# EAGLE design qo-100-relay-controller (EAGLE 9.6.1)
CNAME: None; CREVISION: 1; DESIGNER: Joao Silva

## Sheet 1 of 2: MCU
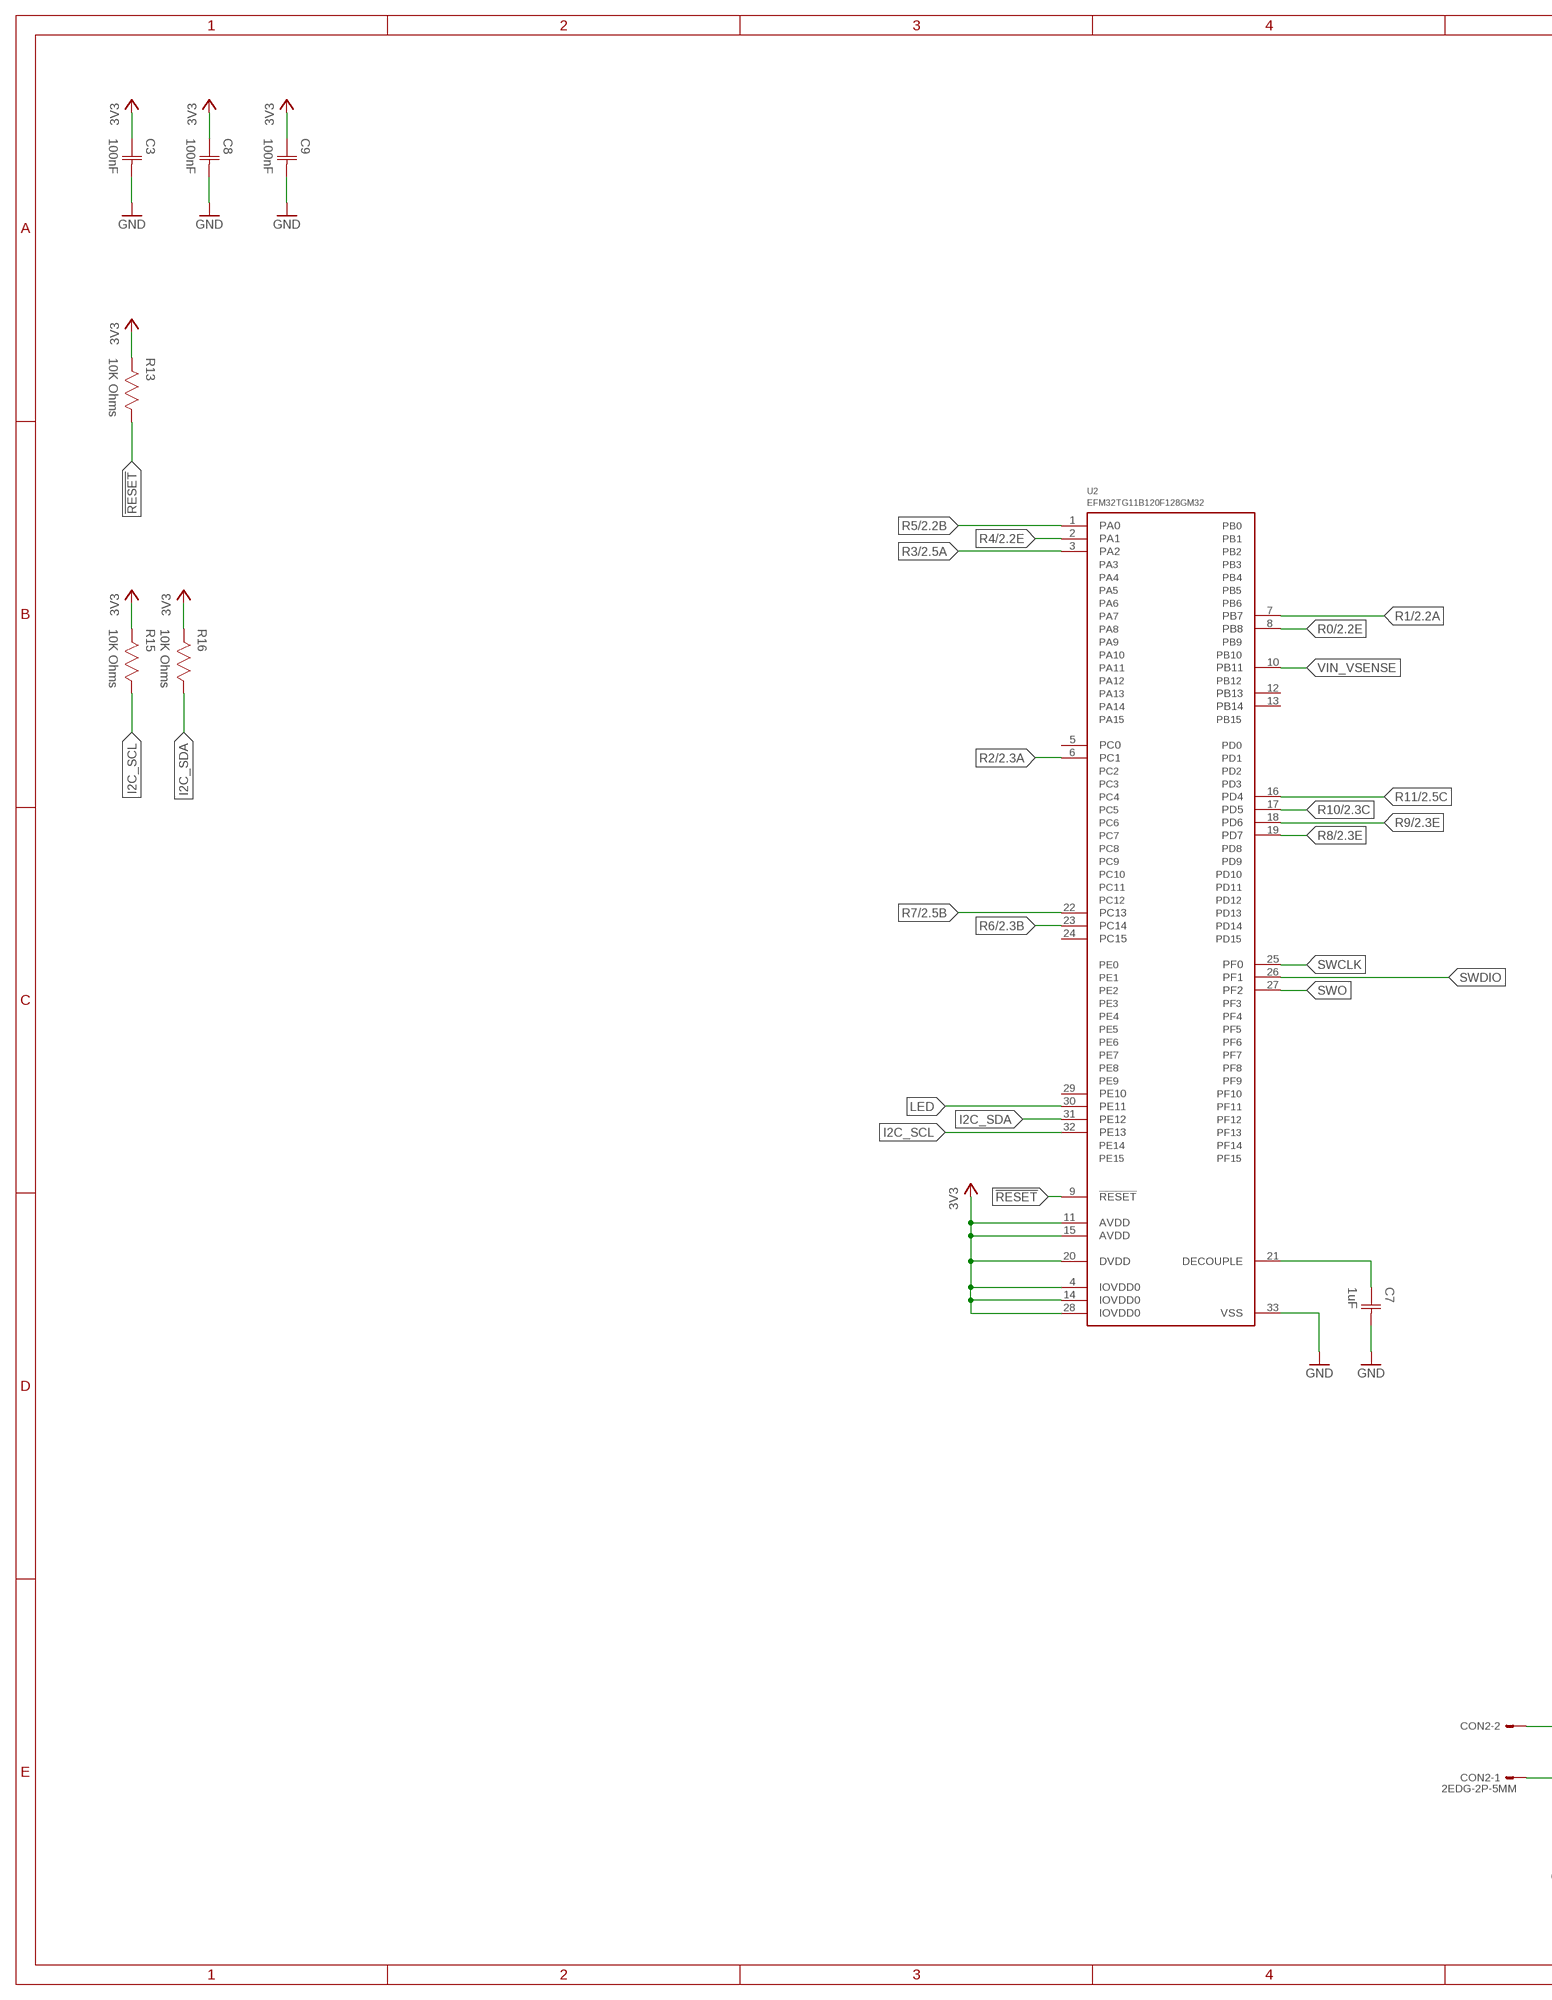
[diagram p0: schematic, sheet 1, part 1 of 2]
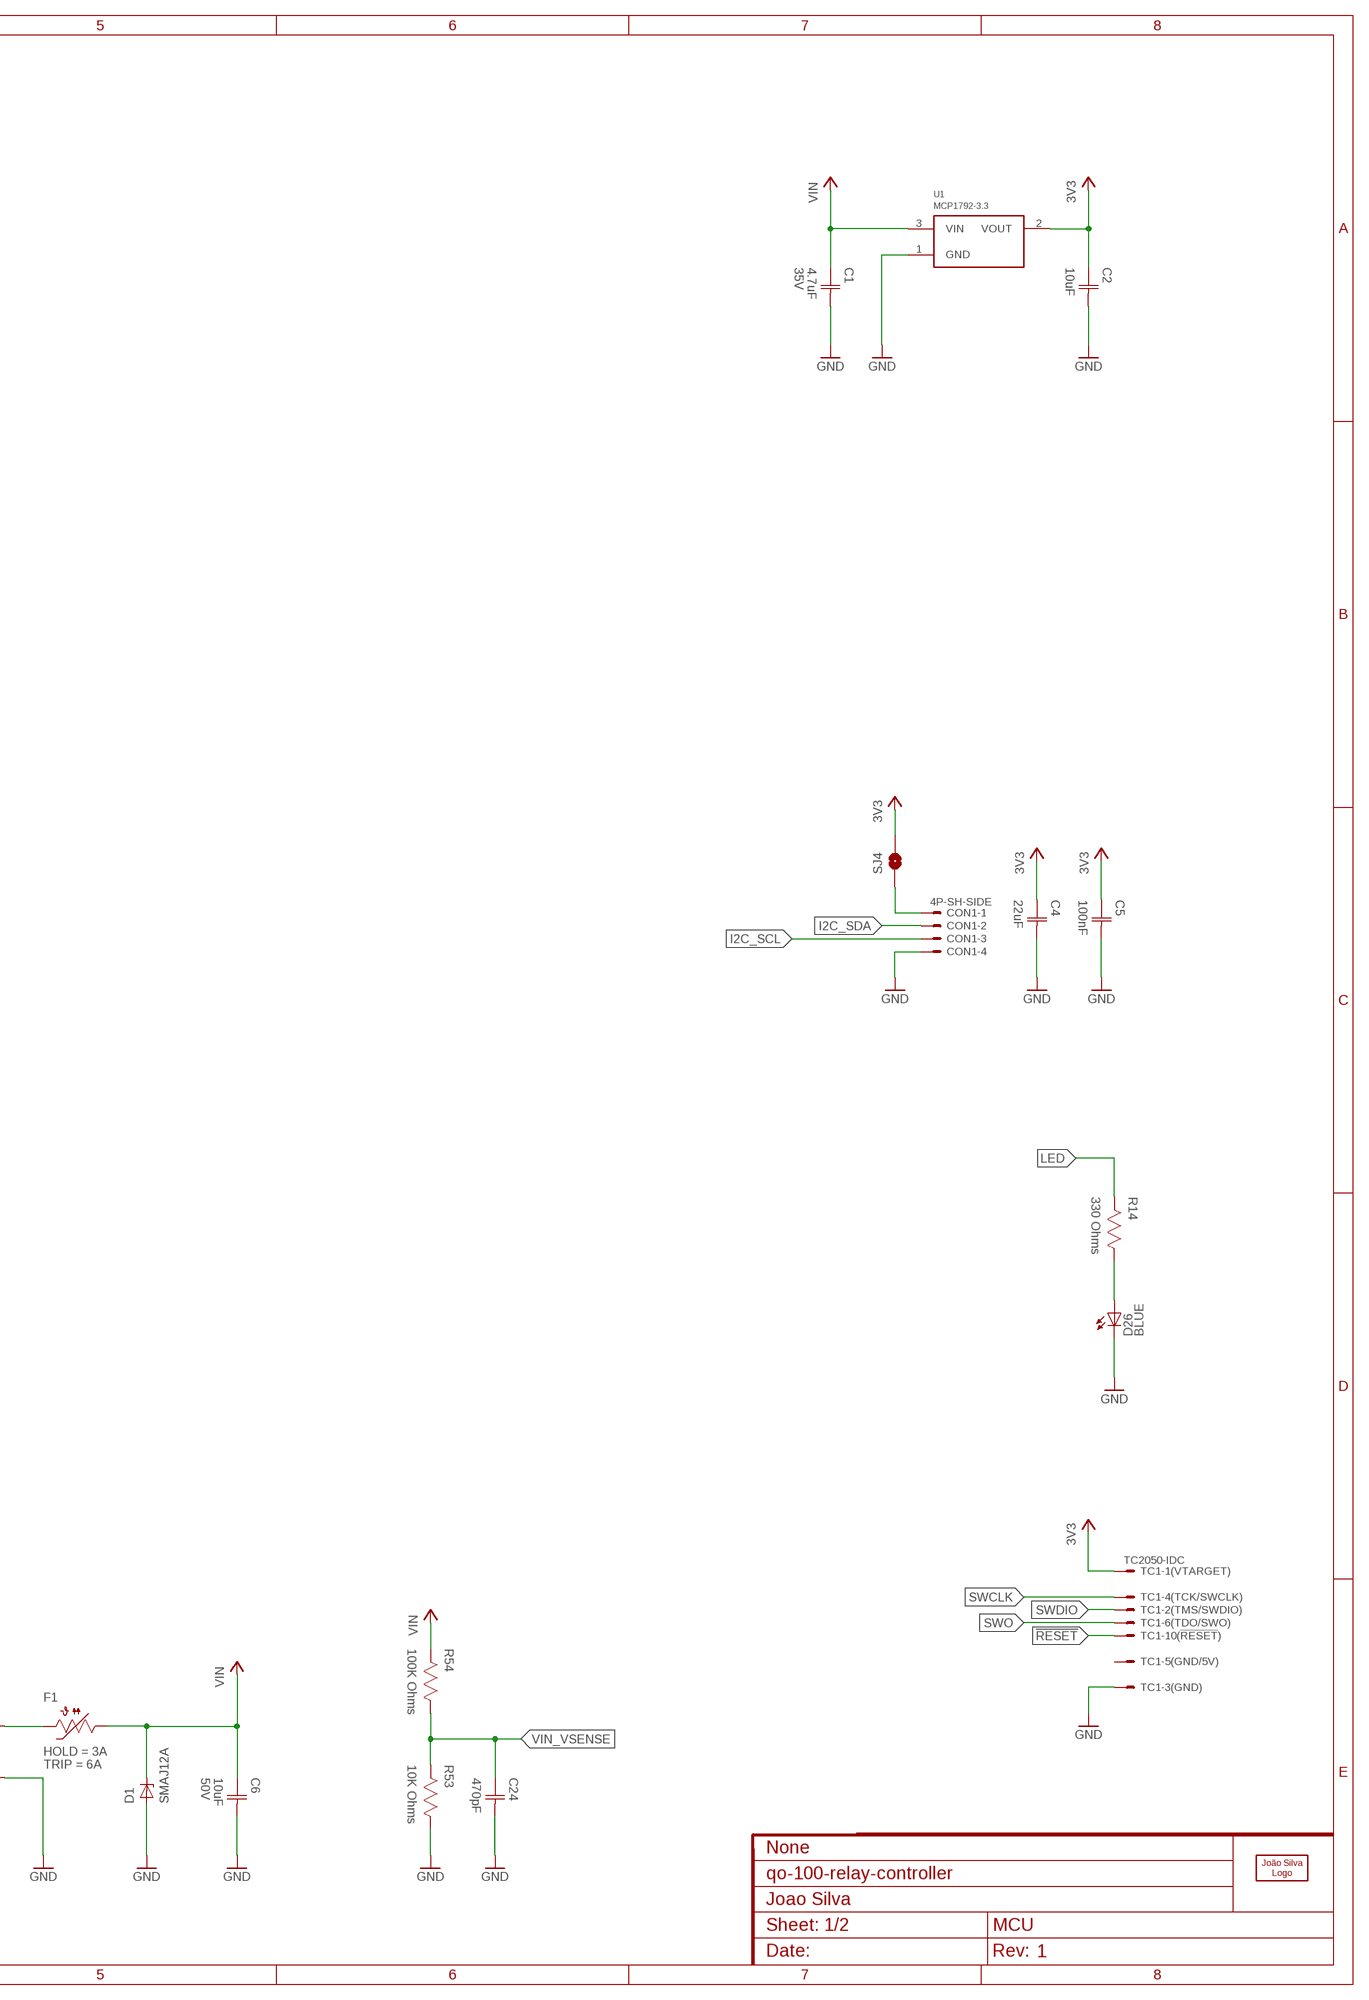
[diagram p1: schematic, sheet 1, part 2 of 2]

### Parts
C1  4.7uF  CAPACITOR-0603  [CAP0603]
C2  10uF  CAPACITOR-0603  [CAP0603]
C3  100nF  CAPACITOR-0603  [CAP0603]
C4  22uF  CAPACITOR-1206  [CAP1206]
C5  100nF  CAPACITOR-0603  [CAP0603]
C6  10uF  CAPACITOR-1206  [CAP1206]
C7  1uF  CAPACITOR-0603  [CAP0603]
C8  100nF  CAPACITOR-0603  [CAP0603]
C9  100nF  CAPACITOR-0603  [CAP0603]
C24  470pF  CAPACITOR-0603  [CAP0603]
CON1  4P-SH-SIDE  [SH-04-SIDE]
CON2  2EDG-2P-5MM  [2EDG-2P-5MM]
D1  SMAJ12A  [DO214AC]
D26  LED0603  [0603]
F1  2.6A Hold  PTC1206  [1206]
LOGO1  JS-5MM  [JS_5MM]
R13  10K Ohms  RESISTOR-0603  [RES0603]
R14  330 Ohms  RESISTOR-0603  [RES0603]
R15  10K Ohms  RESISTOR-0603  [RES0603]
R16  10K Ohms  RESISTOR-0603  [RES0603]
R53  10K Ohms  RESISTOR-0603  [RES0603]
R54  100K Ohms  RESISTOR-0603  [RES0603]
SJ4  SJS  [SJ_S]
TC1  TC2050-IDC  [TC2050-IDC]
U1  MCP1792-3.3  [SOT23]
U2  EFM32TG11B120F128GM32  [QFN32_0.5P_TG]

### Nets
3V3: C2.1(C1) C3.1(C1) C4.1(C1) C5.1(C1) C8.1(C1) C9.1(C1) R13.2 R15.2 R16.2 SJ4.2 TC1.1 U1.2(VOUT) U2.4(IOVDD0) U2.11(AVDD) U2.14(IOVDD0) U2.15(AVDD) U2.20(DVDD) U2.28(IOVDD0) ; also sheet 2
!RESET: R13.1 TC1.10 U2.9(!RESET)
GND: C1.2(C2) C2.2(C2) C3.2(C2) C4.2(C2) C5.2(C2) C6.2(C2) C7.2(C2) C8.2(C2) C9.2(C2) C24.2(C2) CON1.4 CON2.P$1 D1.A D26.C R53.1 TC1.3 U1.1(GND) U2.33(VSS) ; also sheet 2
I2C_SCL: CON1.3 R15.1 U2.32(PE13)
I2C_SDA: CON1.2 R16.1 U2.31(PE12)
LED: R14.2 U2.30(PE11)
N$5: CON1.1 SJ4.1
N$14: C7.1(C1) U2.21(DECOUPLE)
N$15: D26.A R14.1
N$19: CON2.P$2 F1.2
R0: U2.8(PB8) ; also sheet 2
R1: U2.7(PB7) ; also sheet 2
R2: U2.6(PC1) ; also sheet 2
R3: U2.3(PA2) ; also sheet 2
R4: U2.2(PA1) ; also sheet 2
R5: U2.1(PA0) ; also sheet 2
R6: U2.23(PC14) ; also sheet 2
R7: U2.22(PC13) ; also sheet 2
R8: U2.19(PD7) ; also sheet 2
R9: U2.18(PD6) ; also sheet 2
R10: U2.17(PD5) ; also sheet 2
R11: U2.16(PD4) ; also sheet 2
SWCLK: TC1.4 U2.25(PF0)
SWDIO: TC1.2 U2.26(PF1)
SWO: TC1.6 U2.27(PF2)
VIN: C1.1(C1) C6.1(C1) D1.C F1.1 R54.2 U1.3(VIN) ; also sheet 2
VIN_VSENSE: C24.1(C1) R53.2 R54.1 U2.10(PB11)
Unconnected: TC1.5 TC1.7 TC1.8 TC1.9 U2.5(PC0) U2.12(PB13) U2.13(PB14) U2.24(PC15) U2.29(PE10)

## Sheet 2 of 2: Interface
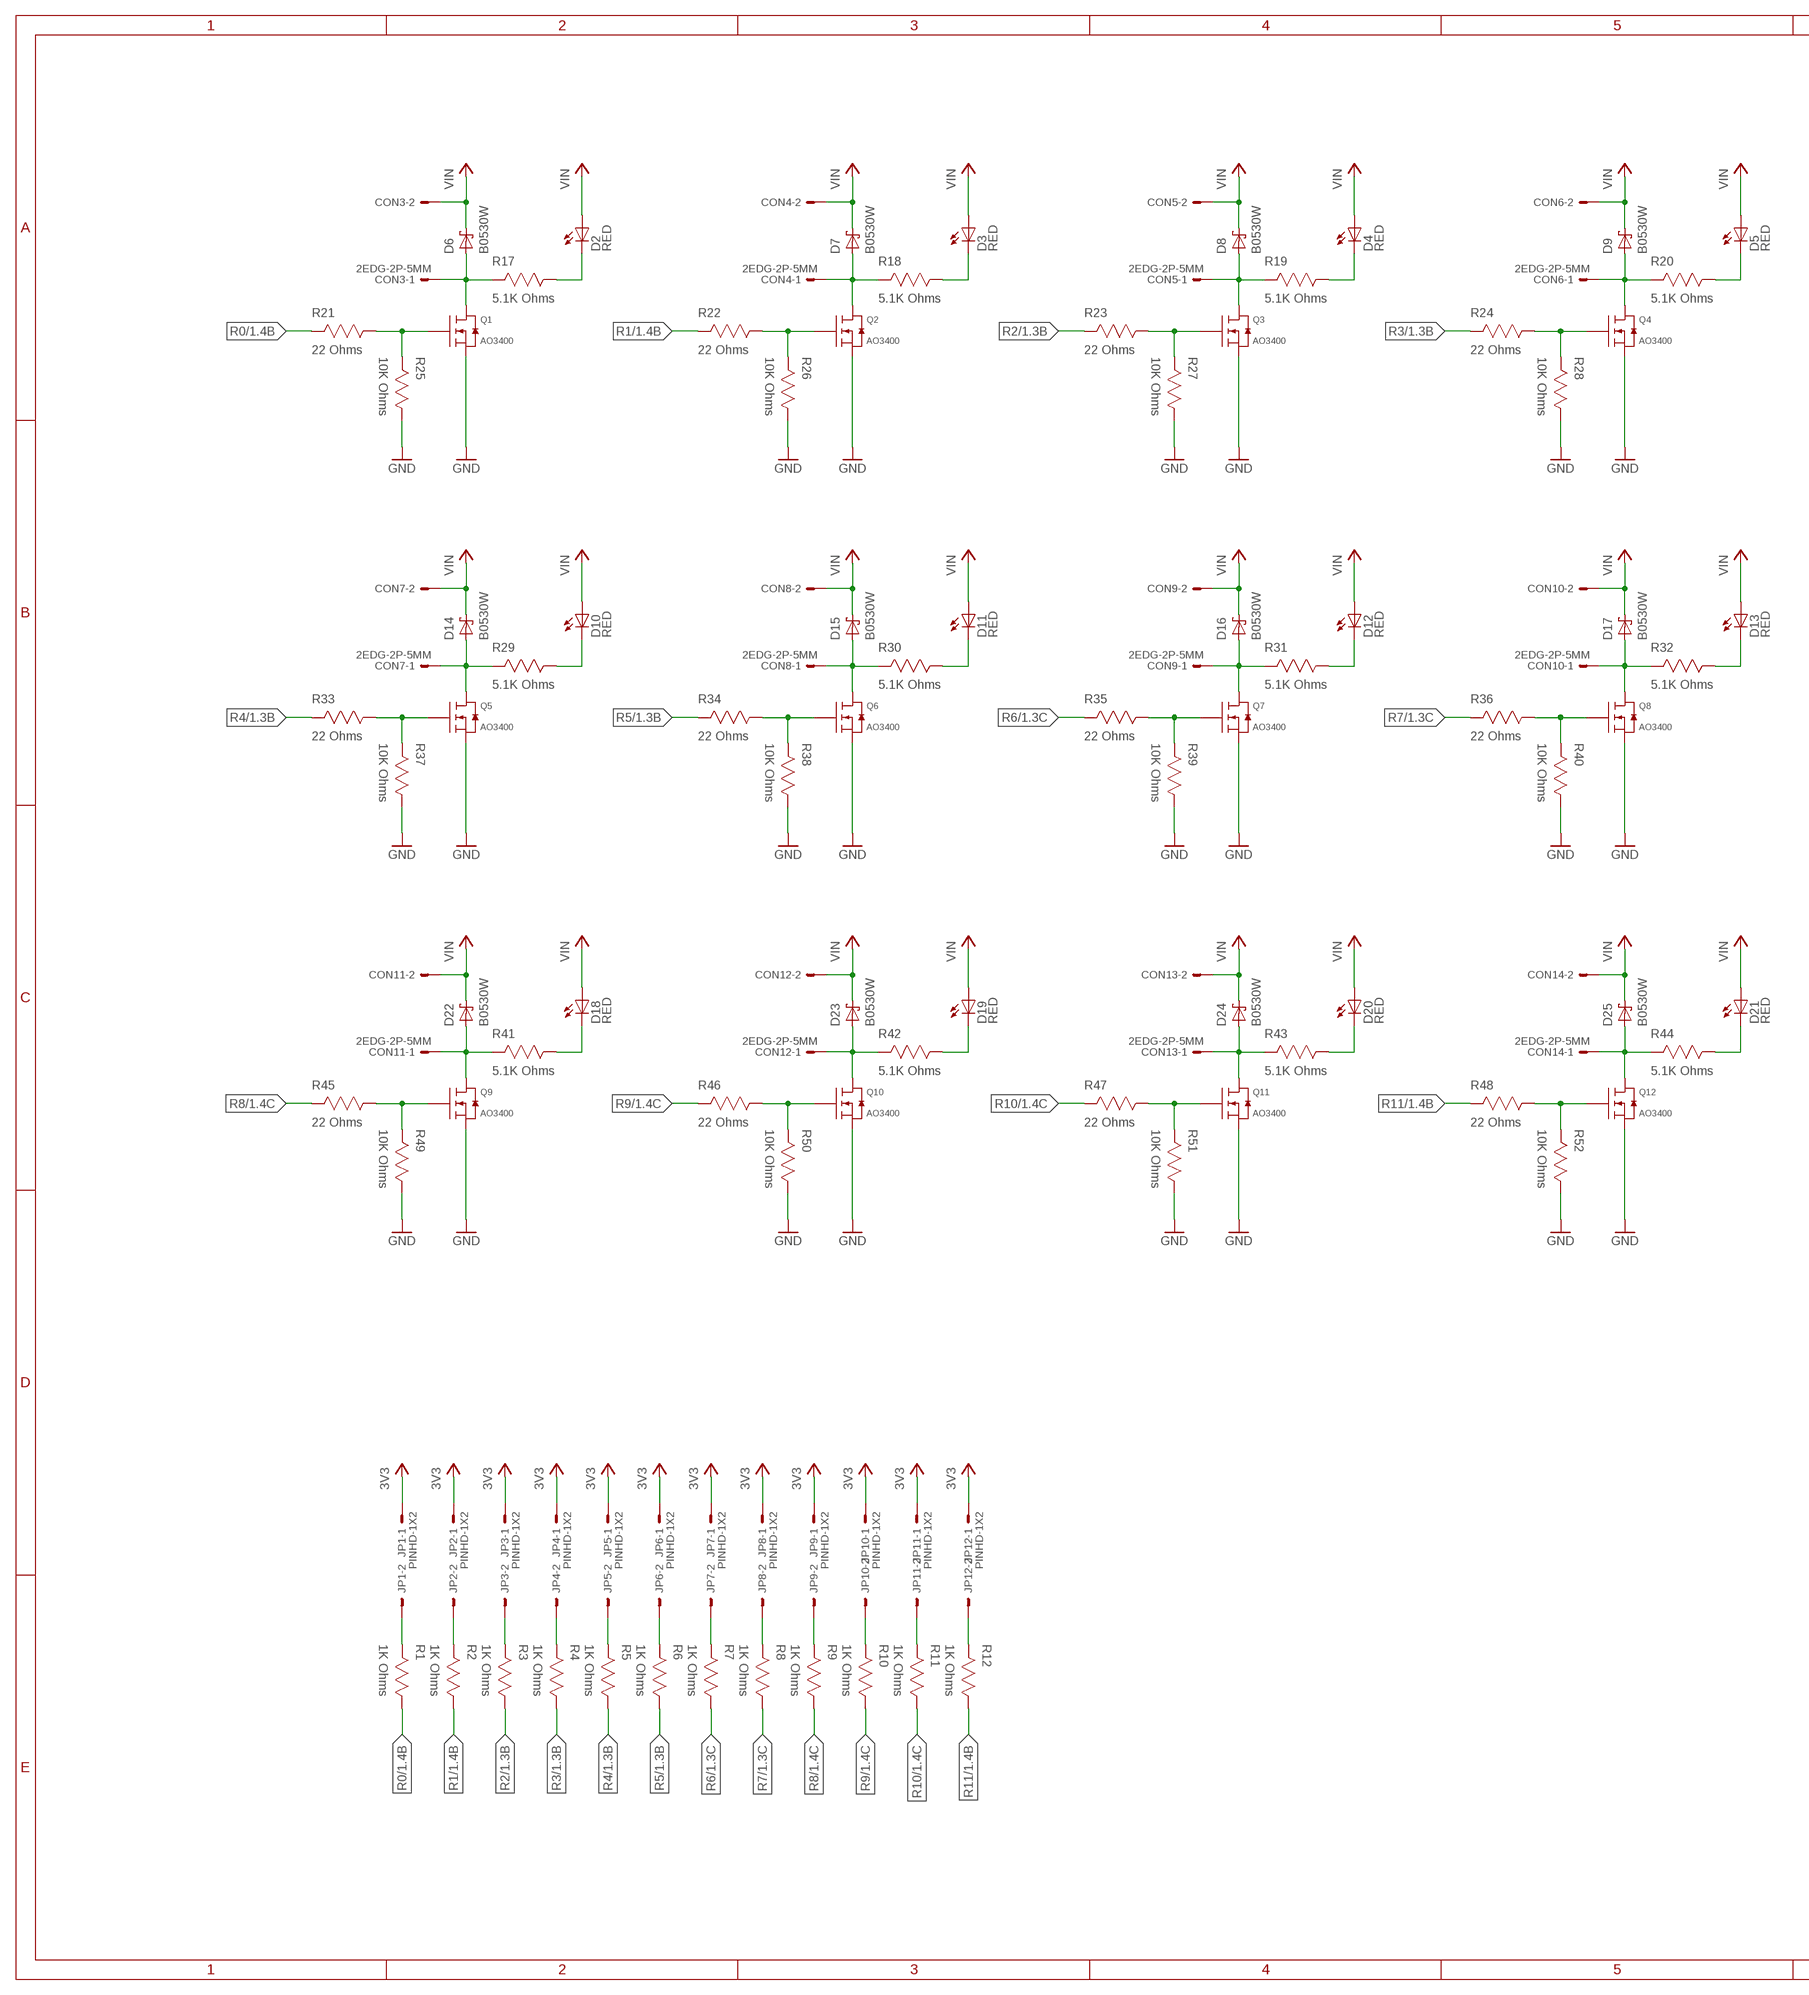
[diagram p2: schematic, sheet 2, part 1 of 2]
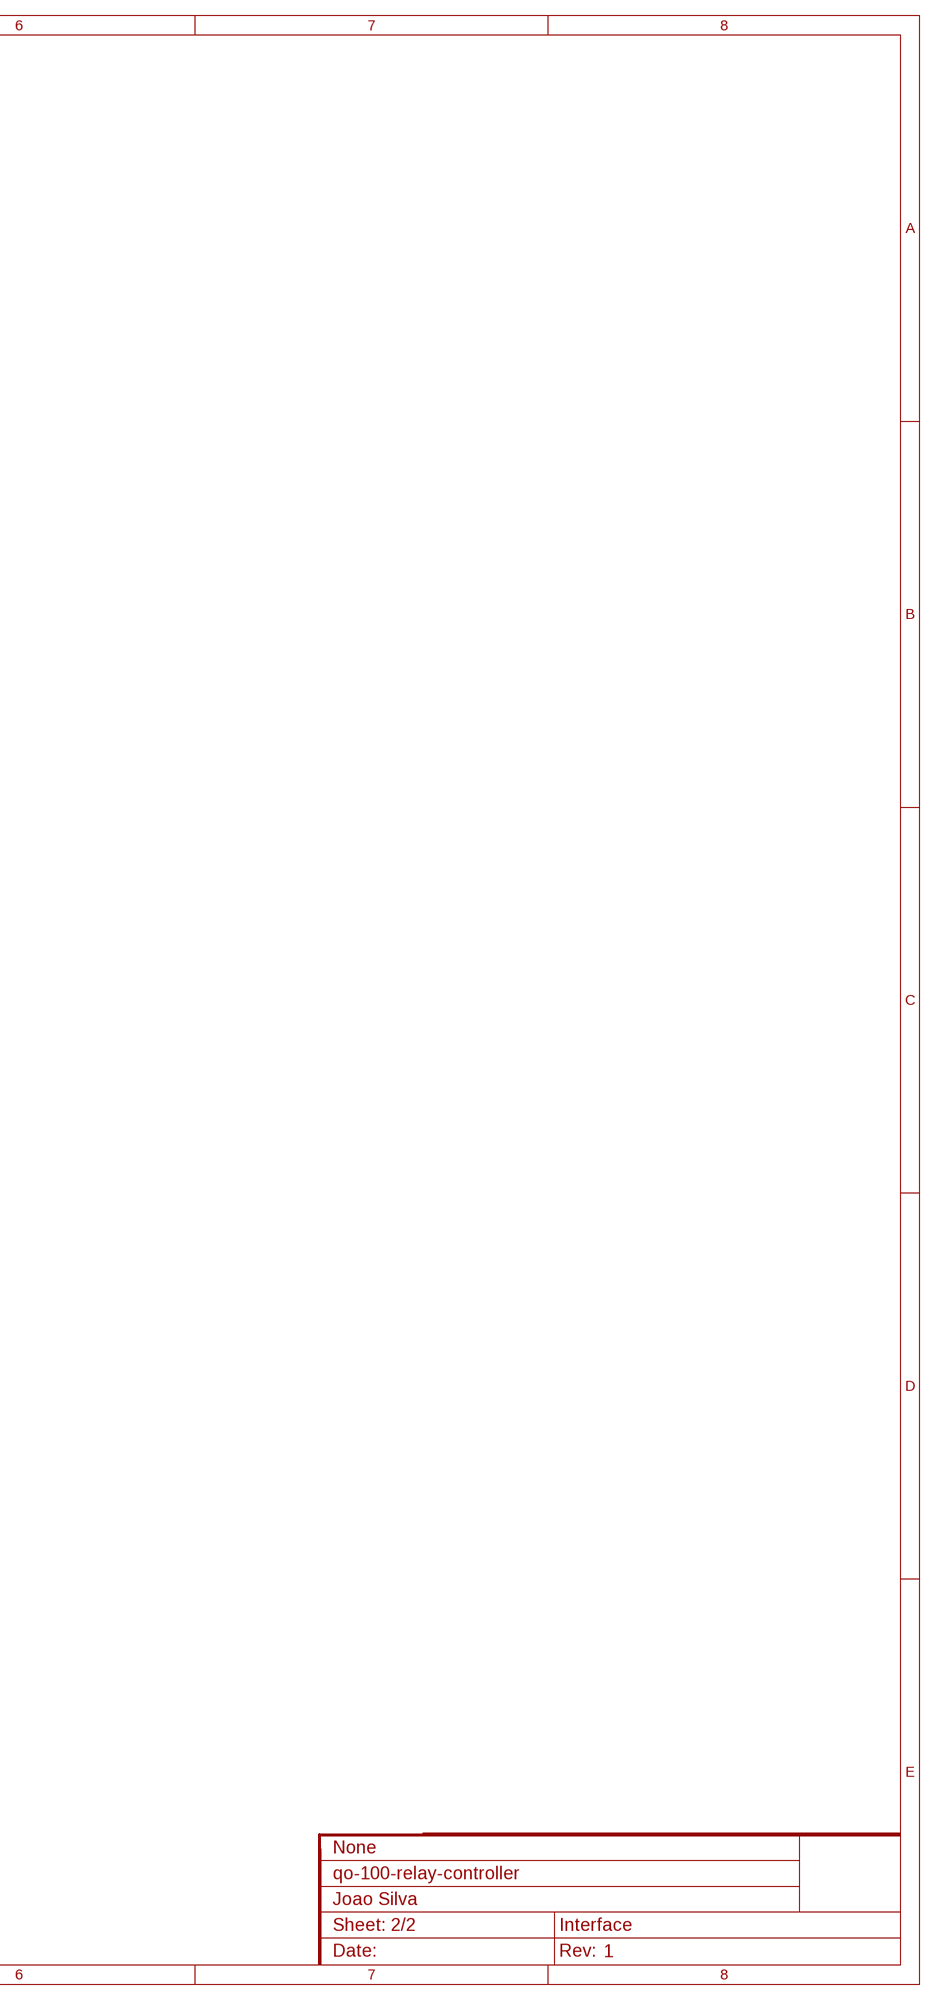
[diagram p3: schematic, sheet 2, part 2 of 2]

### Parts
CON3  2EDG-2P-5MM  [2EDG-2P-5MM]
CON4  2EDG-2P-5MM  [2EDG-2P-5MM]
CON5  2EDG-2P-5MM  [2EDG-2P-5MM]
CON6  2EDG-2P-5MM  [2EDG-2P-5MM]
CON7  2EDG-2P-5MM  [2EDG-2P-5MM]
CON8  2EDG-2P-5MM  [2EDG-2P-5MM]
CON9  2EDG-2P-5MM  [2EDG-2P-5MM]
CON10  2EDG-2P-5MM  [2EDG-2P-5MM]
CON11  2EDG-2P-5MM  [2EDG-2P-5MM]
CON12  2EDG-2P-5MM  [2EDG-2P-5MM]
CON13  2EDG-2P-5MM  [2EDG-2P-5MM]
CON14  2EDG-2P-5MM  [2EDG-2P-5MM]
D2  LED0603  [0603]
D3  LED0603  [0603]
D4  LED0603  [0603]
D5  LED0603  [0603]
D6  B0530W  [SOD-123]
D7  B0530W  [SOD-123]
D8  B0530W  [SOD-123]
D9  B0530W  [SOD-123]
D10  LED0603  [0603]
D11  LED0603  [0603]
D12  LED0603  [0603]
D13  LED0603  [0603]
D14  B0530W  [SOD-123]
D15  B0530W  [SOD-123]
D16  B0530W  [SOD-123]
D17  B0530W  [SOD-123]
D18  LED0603  [0603]
D19  LED0603  [0603]
D20  LED0603  [0603]
D21  LED0603  [0603]
D22  B0530W  [SOD-123]
D23  B0530W  [SOD-123]
D24  B0530W  [SOD-123]
D25  B0530W  [SOD-123]
JP1  PINHD-1X2  [1X02]
JP2  PINHD-1X2  [1X02]
JP3  PINHD-1X2  [1X02]
JP4  PINHD-1X2  [1X02]
JP5  PINHD-1X2  [1X02]
JP6  PINHD-1X2  [1X02]
JP7  PINHD-1X2  [1X02]
JP8  PINHD-1X2  [1X02]
JP9  PINHD-1X2  [1X02]
JP10  PINHD-1X2  [1X02]
JP11  PINHD-1X2  [1X02]
JP12  PINHD-1X2  [1X02]
Q1  AO3400  [SOT23]
Q2  AO3400  [SOT23]
Q3  AO3400  [SOT23]
Q4  AO3400  [SOT23]
Q5  AO3400  [SOT23]
Q6  AO3400  [SOT23]
Q7  AO3400  [SOT23]
Q8  AO3400  [SOT23]
Q9  AO3400  [SOT23]
Q10  AO3400  [SOT23]
Q11  AO3400  [SOT23]
Q12  AO3400  [SOT23]
R1  1K Ohms  RESISTOR-0603  [RES0603]
R2  1K Ohms  RESISTOR-0603  [RES0603]
R3  1K Ohms  RESISTOR-0603  [RES0603]
R4  1K Ohms  RESISTOR-0603  [RES0603]
R5  1K Ohms  RESISTOR-0603  [RES0603]
R6  1K Ohms  RESISTOR-0603  [RES0603]
R7  1K Ohms  RESISTOR-0603  [RES0603]
R8  1K Ohms  RESISTOR-0603  [RES0603]
R9  1K Ohms  RESISTOR-0603  [RES0603]
R10  1K Ohms  RESISTOR-0603  [RES0603]
R11  1K Ohms  RESISTOR-0603  [RES0603]
R12  1K Ohms  RESISTOR-0603  [RES0603]
R17  5.1K Ohms  RESISTOR-0603  [RES0603]
R18  5.1K Ohms  RESISTOR-0603  [RES0603]
R19  5.1K Ohms  RESISTOR-0603  [RES0603]
R20  5.1K Ohms  RESISTOR-0603  [RES0603]
R21  22 Ohms  RESISTOR-0603  [RES0603]
R22  22 Ohms  RESISTOR-0603  [RES0603]
R23  22 Ohms  RESISTOR-0603  [RES0603]
R24  22 Ohms  RESISTOR-0603  [RES0603]
R25  10K Ohms  RESISTOR-0603  [RES0603]
R26  10K Ohms  RESISTOR-0603  [RES0603]
R27  10K Ohms  RESISTOR-0603  [RES0603]
R28  10K Ohms  RESISTOR-0603  [RES0603]
R29  5.1K Ohms  RESISTOR-0603  [RES0603]
R30  5.1K Ohms  RESISTOR-0603  [RES0603]
R31  5.1K Ohms  RESISTOR-0603  [RES0603]
R32  5.1K Ohms  RESISTOR-0603  [RES0603]
R33  22 Ohms  RESISTOR-0603  [RES0603]
R34  22 Ohms  RESISTOR-0603  [RES0603]
R35  22 Ohms  RESISTOR-0603  [RES0603]
R36  22 Ohms  RESISTOR-0603  [RES0603]
R37  10K Ohms  RESISTOR-0603  [RES0603]
R38  10K Ohms  RESISTOR-0603  [RES0603]
R39  10K Ohms  RESISTOR-0603  [RES0603]
R40  10K Ohms  RESISTOR-0603  [RES0603]
R41  5.1K Ohms  RESISTOR-0603  [RES0603]
R42  5.1K Ohms  RESISTOR-0603  [RES0603]
R43  5.1K Ohms  RESISTOR-0603  [RES0603]
R44  5.1K Ohms  RESISTOR-0603  [RES0603]
R45  22 Ohms  RESISTOR-0603  [RES0603]
R46  22 Ohms  RESISTOR-0603  [RES0603]
R47  22 Ohms  RESISTOR-0603  [RES0603]
R48  22 Ohms  RESISTOR-0603  [RES0603]
R49  10K Ohms  RESISTOR-0603  [RES0603]
R50  10K Ohms  RESISTOR-0603  [RES0603]
R51  10K Ohms  RESISTOR-0603  [RES0603]
R52  10K Ohms  RESISTOR-0603  [RES0603]

### Nets
3V3: JP1.1 JP2.1 JP3.1 JP4.1 JP5.1 JP6.1 JP7.1 JP8.1 JP9.1 JP10.1 JP11.1 JP12.1 ; also sheet 1
GND: Q1.2(S) Q2.2(S) Q3.2(S) Q4.2(S) Q5.2(S) Q6.2(S) Q7.2(S) Q8.2(S) Q9.2(S) Q10.2(S) Q11.2(S) Q12.2(S) R25.1 R26.1 R27.1 R28.1 R37.1 R38.1 R39.1 R40.1 R49.1 R50.1 R51.1 R52.1 ; also sheet 1
N$1: JP1.2 R1.2
N$2: JP2.2 R2.2
N$3: JP3.2 R3.2
N$4: JP4.2 R4.2
N$6: JP5.2 R5.2
N$7: JP6.2 R6.2
N$8: JP7.2 R7.2
N$9: JP8.2 R8.2
N$10: JP9.2 R9.2
N$11: JP10.2 R10.2
N$12: JP11.2 R11.2
N$13: JP12.2 R12.2
N$18: Q1.1(G) R21.1 R25.2
N$20: CON3.P$1 D6.A Q1.3(D) R17.2
N$21: D2.C R17.1
N$22: Q2.1(G) R22.1 R26.2
N$23: CON4.P$1 D7.A Q2.3(D) R18.2
N$24: D3.C R18.1
N$25: Q3.1(G) R23.1 R27.2
N$26: CON5.P$1 D8.A Q3.3(D) R19.2
N$27: D4.C R19.1
N$28: Q4.1(G) R24.1 R28.2
N$29: CON6.P$1 D9.A Q4.3(D) R20.2
N$30: D5.C R20.1
N$31: Q5.1(G) R33.1 R37.2
N$32: CON7.P$1 D14.A Q5.3(D) R29.2
N$33: D10.C R29.1
N$34: Q6.1(G) R34.1 R38.2
N$35: CON8.P$1 D15.A Q6.3(D) R30.2
N$36: D11.C R30.1
N$37: Q7.1(G) R35.1 R39.2
N$38: CON9.P$1 D16.A Q7.3(D) R31.2
N$39: D12.C R31.1
N$40: Q8.1(G) R36.1 R40.2
N$41: CON10.P$1 D17.A Q8.3(D) R32.2
N$42: D13.C R32.1
N$43: Q9.1(G) R45.1 R49.2
N$44: CON11.P$1 D22.A Q9.3(D) R41.2
N$45: D18.C R41.1
N$46: Q10.1(G) R46.1 R50.2
N$47: CON12.P$1 D23.A Q10.3(D) R42.2
N$48: D19.C R42.1
N$49: Q11.1(G) R47.1 R51.2
N$50: CON13.P$1 D24.A Q11.3(D) R43.2
N$51: D20.C R43.1
N$52: Q12.1(G) R48.1 R52.2
N$53: CON14.P$1 D25.A Q12.3(D) R44.2
N$54: D21.C R44.1
R0: R1.1 R21.2 ; also sheet 1
R1: R2.1 R22.2 ; also sheet 1
R2: R3.1 R23.2 ; also sheet 1
R3: R4.1 R24.2 ; also sheet 1
R4: R5.1 R33.2 ; also sheet 1
R5: R6.1 R34.2 ; also sheet 1
R6: R7.1 R35.2 ; also sheet 1
R7: R8.1 R36.2 ; also sheet 1
R8: R9.1 R45.2 ; also sheet 1
R9: R10.1 R46.2 ; also sheet 1
R10: R11.1 R47.2 ; also sheet 1
R11: R12.1 R48.2 ; also sheet 1
VIN: CON3.P$2 CON4.P$2 CON5.P$2 CON6.P$2 CON7.P$2 CON8.P$2 CON9.P$2 CON10.P$2 CON11.P$2 CON12.P$2 CON13.P$2 CON14.P$2 D2.A D3.A D4.A D5.A D6.C D7.C D8.C D9.C D10.A D11.A D12.A D13.A D14.C D15.C D16.C D17.C D18.A D19.A D20.A D21.A D22.C D23.C D24.C D25.C ; also sheet 1

## Library data of the parts
C1 = Capacitor:CAPACITOR; VOLTAGE: 35V
C2-C5 C7-C9 C24 = Capacitor:CAPACITOR
C6 = Capacitor:CAPACITOR; VOLTAGE: 50V
CON1 = JST:4P: Disconnectable Crimp style connector, 1.0mm pitch 4 contacts
CON2-CON14 = Generic Connector:2EDG-2P
D1 = TVS:SMAJ*A: SMAJ Series TVS Diodes Source: http://www.littelfuse.com/~/media/electronics/datasheets/tvs_diodes/littelfuse_tvs_diode_smaj_datasheet.pdf.pdf; MF: Littelfuse; MPN: SMAJ12A; OC_FARNELL: 1827602; OC_NEWARK: 71J1937
D2-D5 D10-D13 D18-D21 = LED:LED; COLOR: RED
D6-D9 D14-D17 D22-D25 = Generic Diode:B0530W
D26 = LED:LED; COLOR: BLUE
F1 = PTC Fuses:PTC; HOLD: 3A; OCLCSC: C207041; TRIP: 6A
JP1-JP12 = Pin Header:PINHD-1X2: PIN HEADER
LOGO1 = Silkscreen:JS
Q1-Q12 = Alpha Omega:AO3400
R1-R54 = Resistor:RESISTOR
SJ4 = Solder Jumper:SJ
TC1 = TagConnect:TC2050-IDC
U1 = Microchip:MCP1792-*
U2 = EFM32:EFM32TG11B1*M32

## Board
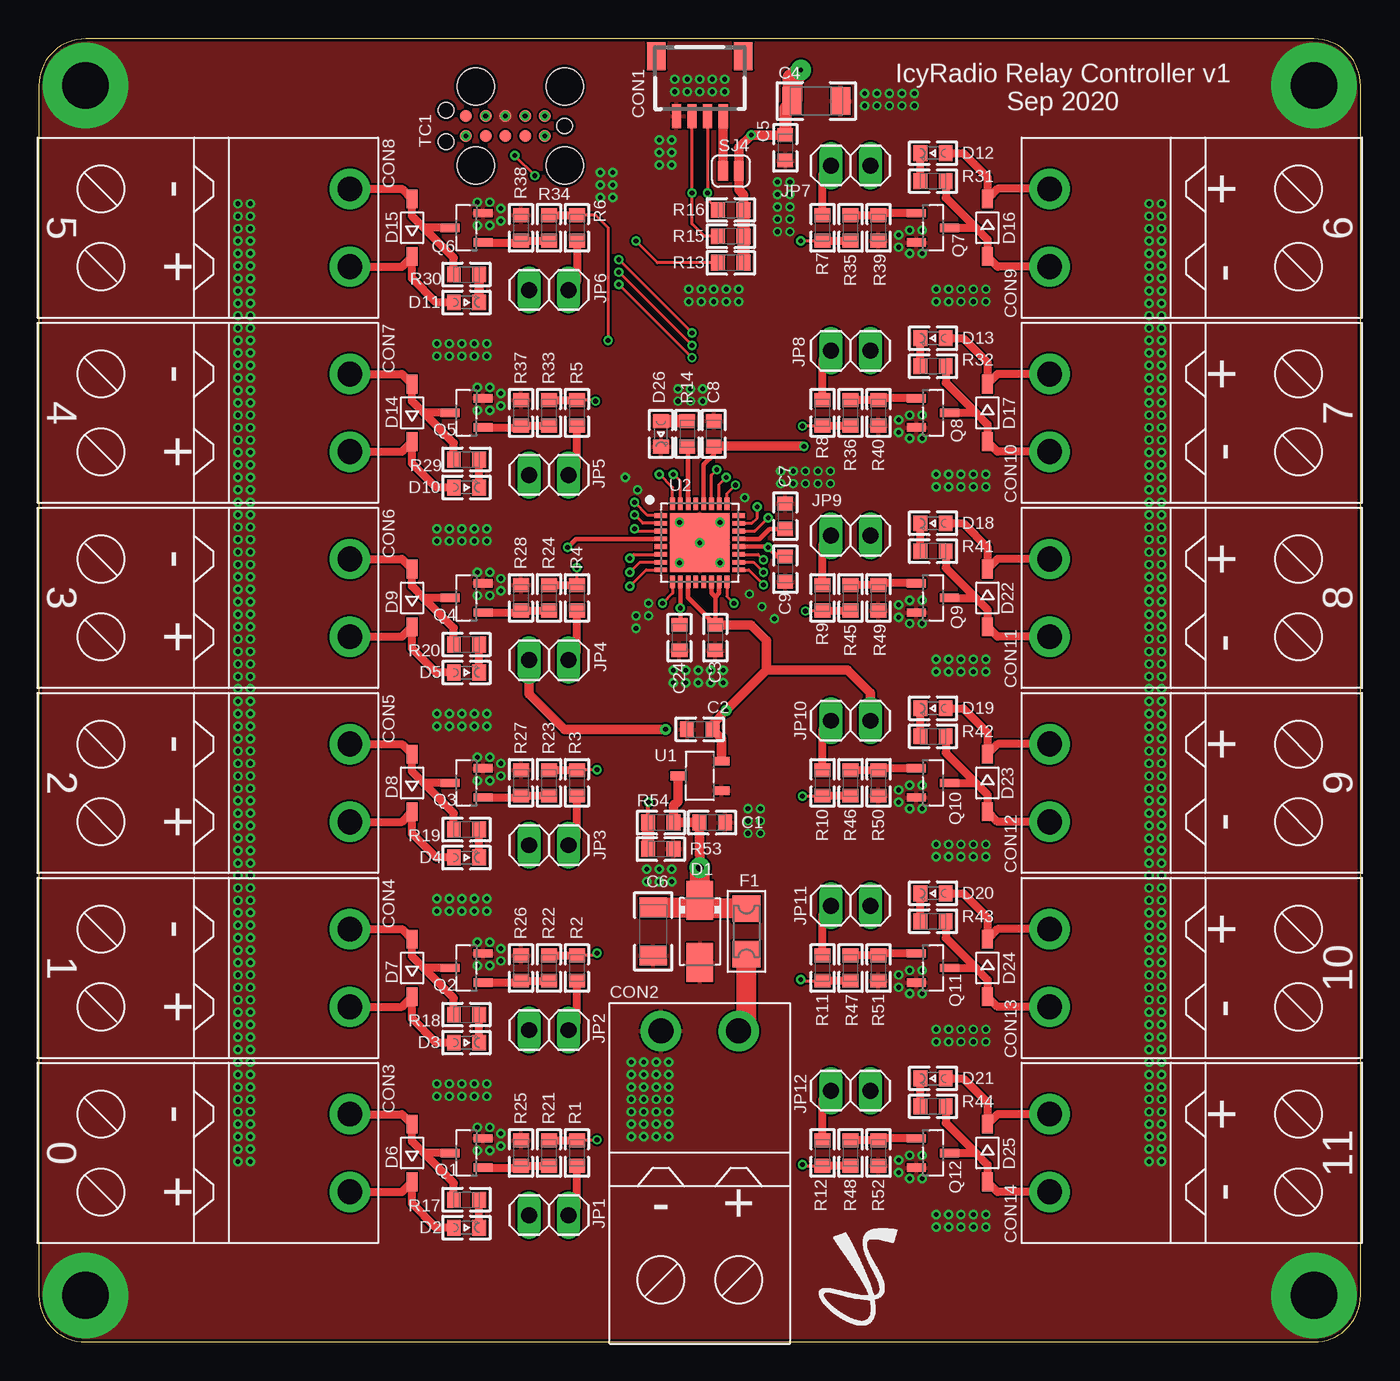
[diagram p4: board, top side]
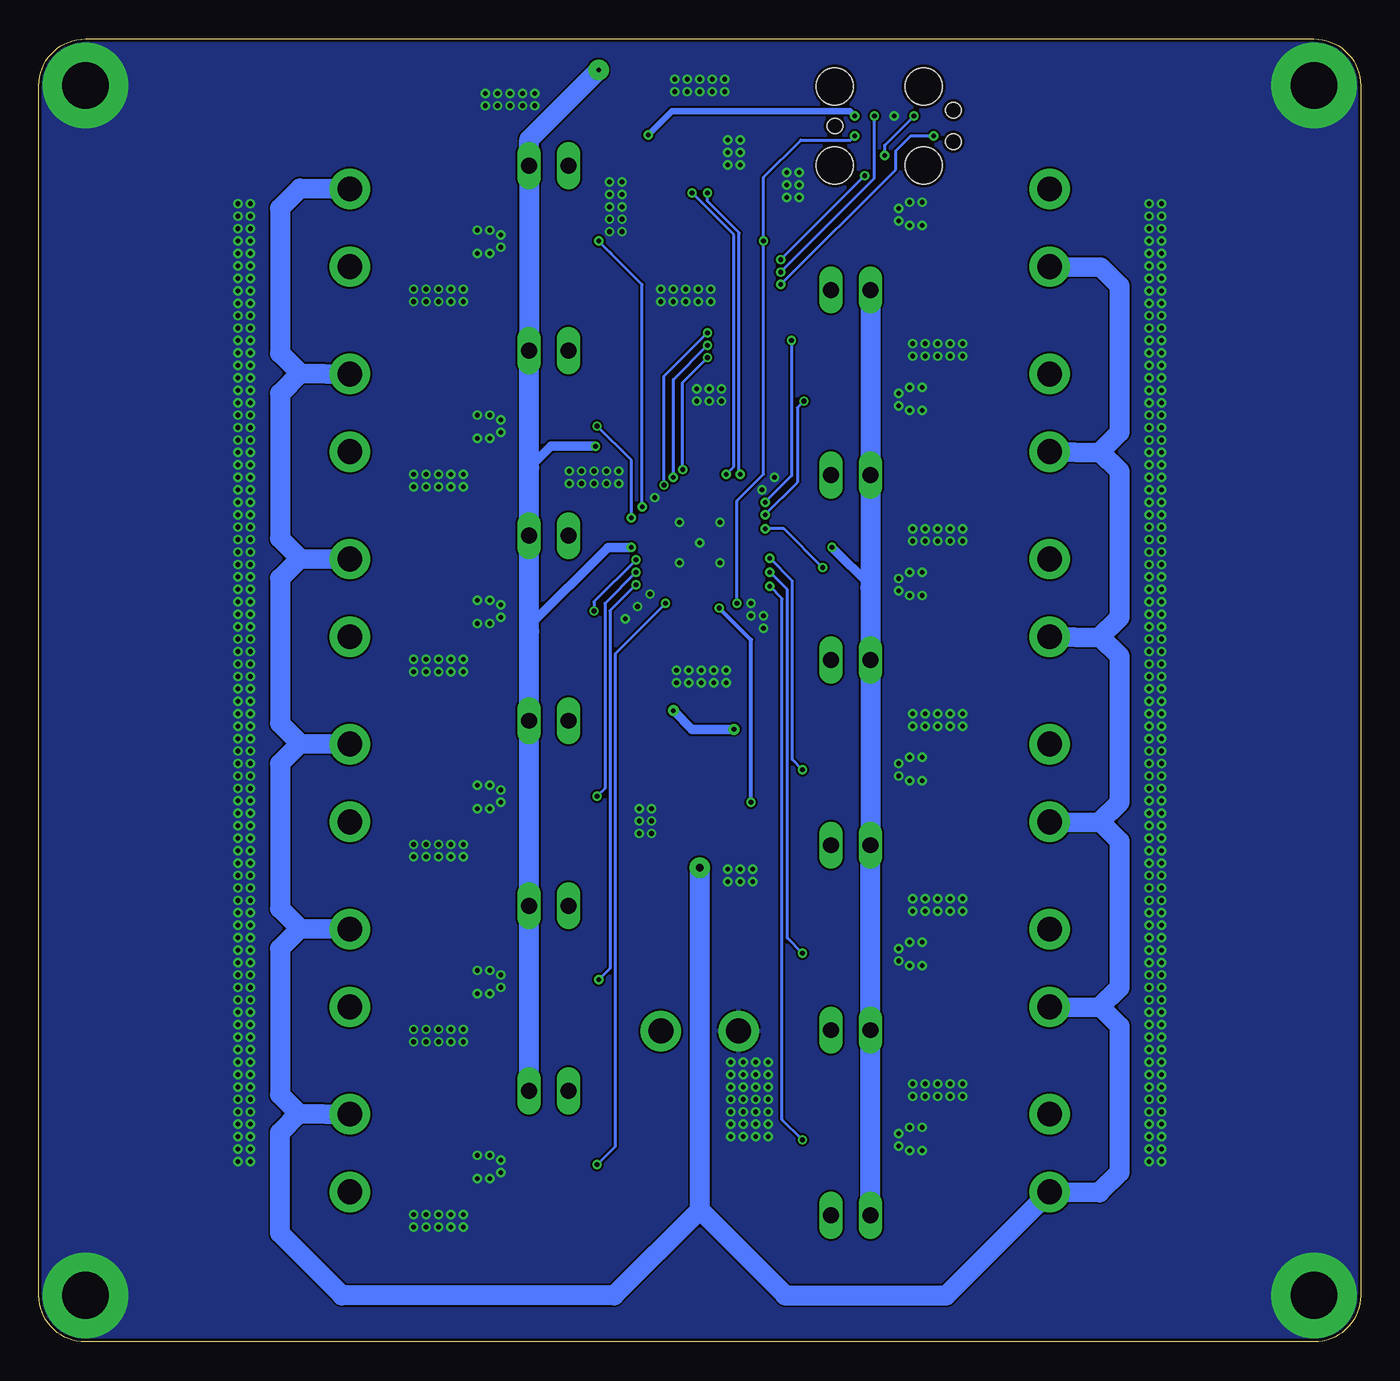
[diagram p5: board, bottom side, seen from below]

Size 85 x 83.8 mm. Coordinates in mm from the lower left corner, seen from the top.
Outline: 0,80.8 0,3 arc90 3,0 82,0 arc90 85,3 85,80.8 arc90 82,83.8 3,83.8 arc90 0,80.8
Copper layers (1*16): Top 0.035mm / dielectric 1.6mm / Bottom 0.035mm
Design rules "jlcpcb_2layer": minimum track width 5mil, minimum drill 0.3mm, track to track 5mil, track to pad 5mil, pad to pad 5mil, via to via 5mil, smd to smd 5mil, copper to edge 0.2mm, drill to drill 5mil, minimum pad ring 3mil, minimum via ring 3mil, stop-mask expansion 0.075mm, vias tented up to drill 10mm, thermal gap 5mil

### Footprints (pad centres in the part's own frame; a part is rotated, then mirrored left to right if it is on the bottom)
CAP0603 = smd 0.889 x 1.016: 1 -0.819,0; 2 0.819,0
CAP1206 = smd 1.27 x 1.778: 1 -1.549,0; 2 1.549,0
SH-04-SIDE = smd 0.6 x 1.55: 1 -1.5,2.975; 2 -0.5,2.975; 3 0.5,2.975; 4 1.5,2.975 | smd 1.2 x 1.8: FIT@1 -2.8,-0.9; FIT@2 2.8,-0.9
2EDG-2P-5MM = drill 1.6 pad 2.6: P$1 -2.5,0; P$2 2.5,0
DO214AC = smd 2.5 x 1.7: A 2,0; C -2,0
0603 = smd 0.889 x 1.016: A 0.819,0; C -0.819,0
SOD-123 = smd 1.2 x 0.7: A 1.85,0; C -1.85,0
1206 = smd 1.7 x 1.803: 1 -1.472,0; 2 1.472,0
1X02 = drill 1.016 long: 1 -1.27,0; 2 1.27,0
SOT23 = smd 1.219 x 0.533: 1 -1.067,0.94; 2 -1.067,-0.94; 3 1.067,0
RES0603 = smd 0.889 x 1.016: 1 -0.819,0; 2 0.819,0
SJ_S = smd 0.635 x 1.27: 1 -0.508,0; 2 0.508,0
TC2050-IDC = smd 0.787 x 0.787: 1 -2.54,-0.635; 2 -1.27,-0.635; 3 0,-0.635; 4 1.27,-0.635; 5 2.54,-0.635; 6 2.54,0.635; 7 1.27,0.635; 8 0,0.635; 9 -1.27,0.635; 10 -2.54,0.635 | hole 0.991: -3.81,0; 3.81,1.016; 3.81,-1.016 | hole 2.375: -3.81,2.54; -3.81,-2.54; 1.905,2.54; 1.905,-2.54
SOT23' = smd 1 x 0.55: 1 -1.4,0.95; 2 -1.4,-0.95; 3 1.394,0
QFN32_0.5P_TG = smd 0.8 x 0.3: 1 -2.5,1.75; 2 -2.5,1.25; 3 -2.5,0.75; 4 -2.5,0.25; 5 -2.5,-0.25; 6 -2.5,-0.75; 7 -2.5,-1.25; 8 -2.5,-1.75; 17 2.5,-1.75; 18 2.5,-1.25; 19 2.5,-0.75; 20 2.5,-0.25; 21 2.5,0.25; 22 2.5,0.75; 23 2.5,1.25; 24 2.5,1.75 | smd 0.3 x 0.8: 9 -1.75,-2.5; 10 -1.25,-2.5; 11 -0.75,-2.5; 12 -0.25,-2.5; 13 0.25,-2.5; 14 0.75,-2.5; 15 1.25,-2.5; 16 1.75,-2.5; 25 1.75,2.5; 26 1.25,2.5; 27 0.75,2.5; 28 0.25,2.5; 29 -0.25,2.5; 30 -0.75,2.5; 31 -1.25,2.5; 32 -1.75,2.5 | smd 3.8 x 3.8: 33 0,0

### Placement (x,y rotation side)
C1  43.3,33.4 0 top
C2  42.5,39.4 180 top
C3  43.5,45.3 270 top
C4  50,79.8 0 top
C5  48,76.8 270 top
C6  39.5,26.4 270 top
C7  48,53.1 90 top
C8  43.4,58.4 90 top
C9  48,49.7 270 top
C24  41.2,45.3 270 top
CON1  42.5,81.8 180 top
CON2  42.5,20 0 top
CON3  20,12.15 270 top
CON4  20,24.05 270 top
CON5  20,35.95 270 top
CON6  20,47.85 270 top
CON7  20,59.75 270 top
CON8  20,71.65 270 top
CON9  65,71.65 90 top
CON10  65,59.75 90 top
CON11  65,47.85 90 top
CON12  65,35.95 90 top
CON13  65,24.05 90 top
CON14  65,12.15 90 top
D1  42.5,26.4 270 top
D2  27.5,7.35 180 top
D3  27.5,19.25 180 top
D4  27.5,31.15 180 top
D5  27.5,43.05 180 top
D6  24,12.15 90 top
D7  24,24.05 90 top
D8  24,35.95 90 top
D9  24,47.85 90 top
D10  27.5,54.95 180 top
D11  27.5,66.85 180 top
D12  57.5,76.45 0 top
D13  57.5,64.55 0 top
D14  24,59.75 90 top
D15  24,71.65 90 top
D16  61,71.65 270 top
D17  61,59.75 270 top
D18  57.5,52.65 0 top
D19  57.5,40.75 0 top
D20  57.5,28.85 0 top
D21  57.5,16.95 0 top
D22  61,47.85 270 top
D23  61,35.95 270 top
D24  61,24.05 270 top
D25  61,12.15 270 top
D26  40,58.4 90 top
F1  45.5,26.4 270 top
JP1  32.8,8.15 0 top
JP2  32.8,20.05 0 top
JP3  32.8,31.95 0 top
JP4  32.8,43.85 0 top
JP5  32.8,55.75 0 top
JP6  32.8,67.65 0 top
JP7  52.2,75.65 180 top
JP8  52.2,63.75 180 top
JP9  52.2,51.85 180 top
JP10  52.2,39.95 180 top
JP11  52.2,28.05 180 top
JP12  52.2,16.15 180 top
LOGO1  55.4,7.5 0 top
Q1  27.5,12.15 180 top
Q2  27.5,24.05 180 top
Q3  27.5,35.95 180 top
Q4  27.5,47.85 180 top
Q5  27.5,59.75 180 top
Q6  27.5,71.65 180 top
Q7  57.5,71.65 0 top
Q8  57.5,59.75 0 top
Q9  57.5,47.85 0 top
Q10  57.5,35.95 0 top
Q11  57.5,24.05 0 top
Q12  57.5,12.15 0 top
R1  34.6,12.15 270 top
R2  34.6,24.05 270 top
R3  34.6,35.95 270 top
R4  34.6,47.85 270 top
R5  34.6,59.75 270 top
R6  34.6,71.65 270 top
R7  50.4,71.65 90 top
R8  50.4,59.75 90 top
R9  50.4,47.85 90 top
R10  50.4,35.95 90 top
R11  50.4,24.05 90 top
R12  50.4,12.15 90 top
R13  44.5,69.4 0 top
R14  41.7,58.4 270 top
R15  44.5,71.1 0 top
R16  44.5,72.8 0 top
R17  27.5,9.15 180 top
R18  27.5,21.05 180 top
R19  27.5,32.95 180 top
R20  27.5,44.85 180 top
R21  32.8,12.15 90 top
R22  32.8,24.05 90 top
R23  32.8,35.95 90 top
R24  32.8,47.85 90 top
R25  31,12.15 270 top
R26  31,24.05 270 top
R27  31,35.95 270 top
R28  31,47.85 270 top
R29  27.5,56.75 180 top
R30  27.5,68.65 180 top
R31  57.5,74.65 0 top
R32  57.5,62.75 0 top
R33  32.8,59.75 90 top
R34  32.8,71.65 90 top
R35  52.2,71.65 270 top
R36  52.2,59.75 270 top
R37  31,59.75 270 top
R38  31,71.65 270 top
R39  54,71.65 90 top
R40  54,59.75 90 top
R41  57.5,50.85 0 top
R42  57.5,38.95 0 top
R43  57.5,27.05 0 top
R44  57.5,15.15 0 top
R45  52.2,47.85 270 top
R46  52.2,35.95 270 top
R47  52.2,24.05 270 top
R48  52.2,12.15 270 top
R49  54,47.85 90 top
R50  54,35.95 90 top
R51  54,24.05 90 top
R52  54,12.15 90 top
R53  40,31.7 180 top
R54  40,33.4 0 top
SJ4  44.5,75.3 0 top
TC1  30,78.2 180 top
U1  MCP1792-3.3  [SOT23']  42.5,36.4 180 top
U2  42.5,51.4 0 top

### Tracks (layer width: path | path; a pad name or v marks a point on that pad's centre or on a via)
3V3  (via drill 0.3, 0.3 pad 0.7, 0.3 pad 1.3)
  Top 0.305: U2.20 46.85,51.15 v46.9,51.1 46.92,51.1 47.5,50.52 C9.1 | U2.14 43.25,48.15 43.5,47.9 | U2.15 43.75,48.15 43.5,47.9 | 43.5,47.9 C3.1 41.75,47.87 U2.11 | U2.4 34.55,51.65 v34,51.1 | U2.28 42.75,56.43 43.4,57.08 C8.1
  Top 0.61: C5.1 v45.82,77.62 45,76.8 45.01,76.79 SJ4.2 45.01,74.09 45.32,73.78 R16.2 | U1.2 43.9,38.82 C2.1 43.32,39.72 v44.2,40.6 46.8,43.2 | JP10.1 53.47,41.73 52,43.2 46.8,43.2 | JP4.1 31.53,41.67 33.8,39.4 v40.3,39.4 | 46.8,43.2 46.8,45.1 45.78,46.12 C3.1 | C8.1 43.42,57.6 v49.2,57.6
  Top 0.813: C5.1 48,79.35 C4.1 | R16.2 R15.2 R13.2
  Top 1.27: v49,81.8 48.45,81.25 C4.1
  Bottom 0.406: v45.82,77.62 44.29,79.15 32.85,79.15 v32.54,78.83
  Bottom 0.61: v40.3,39.4 43,39.4 v44.2,40.6 | 53.47,56.2 52.07,57.6 v49.2,57.6 | v34,51.1 31.53,48.63 31.53,48.5 | v46.9,51.1 48.4,51.1 53.47,46.03 53.47,45.7
  Bottom 1.27: JP6.1 JP5.1 31.53,48.5 JP4.1 JP3.1 JP2.1 JP1.1 | JP12.1 JP11.1 JP10.1 53.47,45.7 JP9.1 53.47,56.2 JP8.1 JP7.1 53.47,77.33 v49,81.8
!RESET  (via drill 0.3)
  Top 0.2: U2.9 40.75,48.15 v40.1,47.5 | R13.1 39.78,69.4 38.4,70.78 v38.4,70.8
  Bottom 0.2: v40.1,47.5 40.1,54.1 38.4,55.8 v38.4,70.8 38.4,74.9 36,77.3 32.8,77.3 TC1.10
  other vias: 32.54,77.56
GND  (via drill 0.3, 3 pad 5.5)
  other vias: 3,80.8 82,80.8 82,3 3,3 30,78.83 42.5,51.4 41.2,52.7 43.8,52.7 43.8,50.1 41.2,50.1 36.9,73.6 36.9,74.4 36.9,75.2 36.1,75.2 36.1,74.4 36.1,73.6 39.2,47.5 39.2,46.7 38.4,46.7 38.4,45.9 47.3,46.5 46.5,47.3 45.7,48.1 45.4,54.3 37.7,55.6 38.5,54.8 28.8,52.3 28.8,51.5 28,52.3 28,51.5 27.2,52.3 27.2,51.5 26.4,52.3 26.4,51.5 25.6,52.3 25.6,51.5 28.8,16.6 28.8,15.8 28,16.6 28,15.8 27.2,16.6 27.2,15.8 26.4,16.6 26.4,15.8 25.6,16.6 25.6,15.8 28.8,28.5 28.8,27.7 28,28.5 28,27.7 27.2,28.5 27.2,27.7 26.4,28.5 26.4,27.7 25.6,28.5 25.6,27.7 28.8,40.4 28.8,39.6 28,40.4 28,39.6 27.2,40.4 27.2,39.6 26.4,40.4 26.4,39.6 25.6,40.4 25.6,39.6 28.8,64.2 28.8,63.4 28,64.2 28,63.4 27.2,64.2 27.2,63.4 26.4,64.2 26.4,63.4 25.6,64.2 25.6,63.4 71.4,73.2 72.2,73.2 71.4,72.4 72.2,72.4 71.4,71.6 72.2,71.6 71.4,70.8 72.2,70.8 71.4,70 72.2,70 71.4,69.2 72.2,69.2 71.4,68.4 72.2,68.4 71.4,67.6 72.2,67.6 71.4,66.8 72.2,66.8 71.4,66 72.2,66 71.4,65.2 72.2,65.2 71.4,64.4 72.2,64.4 71.4,63.6 72.2,63.6 71.4,62.8 72.2,62.8 71.4,62 72.2,62 60.9,67.7 60.9,66.9 60.1,67.7 60.1,66.9 59.3,67.7 59.3,66.9 58.5,67.7 58.5,66.9 57.7,67.7 57.7,66.9 71.4,13.2 72.2,13.2 71.4,12.4 72.2,12.4 71.4,11.6 72.2,11.6 71.4,25.2 72.2,25.2 71.4,24.4 72.2,24.4 71.4,23.6 72.2,23.6 71.4,22.8 72.2,22.8 71.4,22 72.2,22 71.4,21.2 72.2,21.2 71.4,20.4 72.2,20.4 71.4,19.6 72.2,19.6 71.4,18.8 72.2,18.8 71.4,18 72.2,18 71.4,17.2 72.2,17.2 71.4,16.4 72.2,16.4 71.4,15.6 72.2,15.6 71.4,14.8 72.2,14.8 71.4,14 72.2,14 71.4,37.2 72.2,37.2 71.4,36.4 72.2,36.4 71.4,35.6 72.2,35.6 71.4,34.8 72.2,34.8 71.4,34 72.2,34 71.4,33.2 72.2,33.2 71.4,32.4 72.2,32.4 71.4,31.6 72.2,31.6 71.4,30.8 72.2,30.8 71.4,30 72.2,30 71.4,29.2 72.2,29.2 71.4,28.4 72.2,28.4 71.4,27.6 72.2,27.6 71.4,26.8 72.2,26.8 71.4,26 72.2,26 71.4,49.2 72.2,49.2 71.4,48.4 72.2,48.4 71.4,47.6 72.2,47.6 71.4,46.8 72.2,46.8 71.4,46 72.2,46 71.4,45.2 72.2,45.2 71.4,44.4 72.2,44.4 71.4,43.6 72.2,43.6 71.4,42.8 72.2,42.8 71.4,42 72.2,42 71.4,41.2 72.2,41.2 71.4,40.4 72.2,40.4 71.4,39.6 72.2,39.6 71.4,38.8 72.2,38.8 71.4,38 72.2,38 71.4,61.2 72.2,61.2 71.4,60.4 72.2,60.4 71.4,59.6 72.2,59.6 71.4,58.8 72.2,58.8 71.4,58 72.2,58 71.4,57.2 72.2,57.2 71.4,56.4 72.2,56.4 71.4,55.6 72.2,55.6 71.4,54.8 72.2,54.8 71.4,54 72.2,54 71.4,53.2 72.2,53.2 71.4,52.4 72.2,52.4 71.4,51.6 72.2,51.6 71.4,50.8 72.2,50.8 71.4,50 72.2,50 12.8,73.2 13.6,73.2 12.8,72.4 13.6,72.4 12.8,71.6 13.6,71.6 12.8,70.8 13.6,70.8 12.8,70 13.6,70 12.8,69.2 13.6,69.2 12.8,68.4 13.6,68.4 12.8,67.6 13.6,67.6 12.8,66.8 13.6,66.8 12.8,66 13.6,66 12.8,65.2 13.6,65.2 12.8,64.4 13.6,64.4 12.8,63.6 13.6,63.6 12.8,62.8 13.6,62.8 12.8,62 13.6,62 12.8,13.2 13.6,13.2 12.8,12.4 13.6,12.4 12.8,11.6 13.6,11.6 12.8,25.2 13.6,25.2 12.8,24.4 13.6,24.4 12.8,23.6 13.6,23.6 12.8,22.8 13.6,22.8 12.8,22 13.6,22 12.8,21.2 13.6,21.2 12.8,20.4 13.6,20.4 12.8,19.6 13.6,19.6 12.8,18.8 13.6,18.8 12.8,18 13.6,18 12.8,17.2 13.6,17.2 12.8,16.4 13.6,16.4 12.8,15.6 13.6,15.6 12.8,14.8 13.6,14.8 12.8,14 13.6,14 12.8,37.2 13.6,37.2 12.8,36.4 13.6,36.4 12.8,35.6 13.6,35.6 12.8,34.8 13.6,34.8 12.8,34 13.6,34 12.8,33.2 13.6,33.2 12.8,32.4 13.6,32.4 12.8,31.6 13.6,31.6 12.8,30.8 13.6,30.8 12.8,30 13.6,30 12.8,29.2 13.6,29.2 12.8,28.4 13.6,28.4 12.8,27.6 13.6,27.6 12.8,26.8 13.6,26.8 12.8,26 13.6,26 12.8,49.2 13.6,49.2 12.8,48.4 13.6,48.4 12.8,47.6 13.6,47.6 12.8,46.8 13.6,46.8 12.8,46 13.6,46 12.8,45.2 13.6,45.2 12.8,44.4 13.6,44.4 12.8,43.6 13.6,43.6 12.8,42.8 13.6,42.8 12.8,42 13.6,42 12.8,41.2 13.6,41.2 12.8,40.4 13.6,40.4 12.8,39.6 13.6,39.6 12.8,38.8 13.6,38.8 12.8,38 13.6,38 12.8,61.2 13.6,61.2 12.8,60.4 13.6,60.4 12.8,59.6 13.6,59.6 12.8,58.8 13.6,58.8 12.8,58 13.6,58 12.8,57.2 13.6,57.2 12.8,56.4 13.6,56.4 12.8,55.6 13.6,55.6 12.8,54.8 13.6,54.8 12.8,54 13.6,54 12.8,53.2 13.6,53.2 12.8,52.4 13.6,52.4 12.8,51.6 13.6,51.6 12.8,50.8 13.6,50.8 12.8,50 13.6,50 39.7,14.8 40.5,14.8 39.7,14 40.5,14 39.7,13.2 40.5,13.2 39.7,18 40.5,18 39.7,17.2 40.5,17.2 39.7,16.4 40.5,16.4 39.7,15.6 40.5,15.6 38.1,14.8 38.9,14.8 38.1,14 38.9,14 38.1,13.2 38.9,13.2 38.1,18 38.9,18 38.1,17.2 38.9,17.2 38.1,16.4 38.9,16.4 38.1,15.6 38.9,15.6 44,43.2 44,42.4 43.2,43.2 43.2,42.4 42.4,43.2 42.4,42.4 41.6,43.2 41.6,42.4 40.8,43.2 40.8,42.4 50.9,56 50.9,55.2 50.1,56 50.1,55.2 49.3,56 49.3,55.2 48.5,56 48.5,55.2 47.7,56 47.7,55.2 45,67.7 45,66.9 44.2,67.7 44.2,66.9 43.4,67.7 43.4,66.9 42.6,67.7 42.6,66.9 41.8,67.7 41.8,66.9 47.5,74.6 48.3,74.6 47.5,73.8 48.3,73.8 47.5,73 48.3,73 47.5,72.2 48.3,72.2 47.5,71.4 48.3,71.4 56.3,80.3 56.3,79.5 55.5,80.3 55.5,79.5 54.7,80.3 54.7,79.5 53.9,80.3 53.9,79.5 53.1,80.3 53.1,79.5 44.1,81.2 44.1,80.4 43.3,81.2 43.3,80.4 42.5,81.2 42.5,80.4 41.7,81.2 41.7,80.4 40.9,81.2 40.9,80.4 29,73.3 28.2,73.3 29.7,72.9 29.7,72.1 29,71.8 28.2,71.8 56,70 56.8,70 55.3,70.4 55.3,71.2 56,71.5 56.8,71.5 60.9,8.2 60.9,7.4 60.1,8.2 60.1,7.4 59.3,8.2 59.3,7.4 58.5,8.2 58.5,7.4 57.7,8.2 57.7,7.4 29,13.8 28.2,13.8 29.7,13.4 29.7,12.6 29,12.3 28.2,12.3 56,10.5 56.8,10.5 55.3,10.9 55.3,11.7 56,12 56.8,12 60.9,20.1 60.9,19.3 60.1,20.1 60.1,19.3 59.3,20.1 59.3,19.3 58.5,20.1 58.5,19.3 57.7,20.1 57.7,19.3 29,25.7 28.2,25.7 29.7,25.3 29.7,24.5 29,24.2 28.2,24.2 56,22.4 56.8,22.4 55.3,22.8 55.3,23.6 56,23.9 56.8,23.9 60.9,32 60.9,31.2 60.1,32 60.1,31.2 59.3,32 59.3,31.2 58.5,32 58.5,31.2 57.7,32 57.7,31.2 29,37.6 28.2,37.6 29.7,37.2 29.7,36.4 29,36.1 28.2,36.1 56,34.3 56.8,34.3 55.3,34.7 55.3,35.5 56,35.8 56.8,35.8 60.9,43.9 60.9,43.1 60.1,43.9 60.1,43.1 59.3,43.9 59.3,43.1 58.5,43.9 58.5,43.1 57.7,43.9 57.7,43.1 29,49.5 28.2,49.5 29.7,49.1 29.7,48.3 29,48 28.2,48 56,46.2 56.8,46.2 55.3,46.6 55.3,47.4 56,47.7 56.8,47.7 60.9,55.8 60.9,55 60.1,55.8 60.1,55 59.3,55.8 59.3,55 58.5,55.8 58.5,55 57.7,55.8 57.7,55 29,61.4 28.2,61.4 29.7,61 29.7,60.2 29,59.9 28.2,59.9 56,58.1 56.8,58.1 55.3,58.5 55.3,59.3 56,59.6 56.8,59.6 42.7,61.3 42.7,60.5 41.9,61.3 41.9,60.5 41.1,61.3 41.1,60.5 40.7,30.4 40.7,29.6 39.9,30.4 39.9,29.6 39.1,30.4 39.1,29.6 45.6,34.3 46.4,34.3 45.6,33.5 46.4,33.5 45.6,32.7 46.4,32.7 39.9,77.3 40.7,77.3 39.9,76.5 40.7,76.5 39.9,75.7 40.7,75.7
  pour Top (rank 6): -1,-1 -1,84.8 86,84.8 86,-1
  pour Bottom (rank 6): -2,-2 87,-2 87,85.8 -2,85.8
I2C_SCL  (via drill 0.3)
  Top 0.2: CON1.3 v42,73.9 42,71.9 42.8,71.1 R15.1 | U2.32 40.75,54.95 v39.9,55.8
  Bottom 0.2: v39.9,55.8 39.97,55.87 39.97,71.33 42,73.36 v42,73.9
I2C_SDA  (via drill 0.3)
  Top 0.2: R16.1 43,73.48 v43,73.9 CON1.2 | U2.31 41.25,55.35 v40.8,55.8
  Bottom 0.2: v40.8,55.8 40.3,56.3 40.3,71.2 v43,73.9
LED
  Top 0.305: U2.30 41.75,57.53 R14.2
N$1
  Top 0.508: JP1.2 34.6,8.68 R1.2
N$2
  Top 0.508: JP2.2 34.6,20.58 R2.2
N$3
  Top 0.508: JP3.2 34.6,32.48 R3.2
N$4
  Top 0.508: JP4.2 34.6,44.38 R4.2
N$5
  Top 0.61: SJ4.1 43.99,78.82 CON1.1
N$6
  Top 0.508: JP5.2 34.6,56.28 R5.2
N$7
  Top 0.508: R6.2 34.6,68.18 JP6.2
N$8
  Top 0.508: R7.2 50.4,75.12 JP7.2
N$9
  Top 0.508: R8.2 50.4,63.22 JP8.2
N$10
  Top 0.508: R9.2 50.4,51.32 JP9.2
N$11
  Top 0.508: R10.2 50.4,39.42 JP10.2
N$12
  Top 0.508: R11.2 50.4,27.52 JP11.2
N$13
  Top 0.508: R12.2 50.4,15.62 JP12.2
N$14
  Top 0.305: U2.21 46.35,51.65 46.98,52.28 C7.1
N$15
  Top 0.813: D26.A R14.1
N$18
  Top 0.508: Q1.1 30.88,11.21 R25.2 R21.1
N$19
  Top 1.27: 45.5,21.34 F1.2 45.5,20.5 CON2.P$2
N$20
  Top 0.508: Q1.3 24.75,12.15 | 24.75,12.15 24,12.9 D6.A 23.35,14.65 CON3.P$1 | R17.2 26.68,10.22 24.75,12.15
N$21
  Top 0.508: D2.C R17.1
N$22
  Top 0.508: Q2.1 30.88,23.11 R26.2 R22.1
N$23
  Top 0.508: Q2.3 24.75,24.05 | 24.75,24.05 24,24.8 D7.A 23.35,26.55 CON4.P$1 | R18.2 26.68,22.12 24.75,24.05
N$24
  Top 0.508: D3.C R18.1
N$25
  Top 0.508: Q3.1 30.88,35.01 R27.2 R23.1
N$26
  Top 0.508: Q3.3 24.75,35.95 | 24.75,35.95 24,36.7 D8.A 23.35,38.45 CON5.P$1 | R19.2 26.68,34.02 24.75,35.95
N$27
  Top 0.508: D4.C R19.1
N$28
  Top 0.508: Q4.1 30.88,46.91 R28.2 R24.1
N$29
  Top 0.508: Q4.3 24.75,47.85 | 24.75,47.85 24,48.6 D9.A 23.35,50.35 CON6.P$1 | R20.2 26.68,45.92 24.75,47.85
N$30
  Top 0.508: D5.C R20.1
N$31
  Top 0.508: Q5.1 30.88,58.81 R37.2 R33.1
N$32
  Top 0.508: Q5.3 24.75,59.75 | 24.75,59.75 24,60.5 D14.A 23.35,62.25 CON7.P$1 | R29.2 26.68,57.82 24.75,59.75
N$33
  Top 0.508: D10.C R29.1
N$34
  Top 0.508: Q6.1 30.88,70.71 R38.2 R34.1
N$35
  Top 0.508: Q6.3 24.75,71.65 | 24.75,71.65 24,72.4 D15.A 23.35,74.15 CON8.P$1 | R30.2 26.68,69.72 24.75,71.65
N$36
  Top 0.61: D11.C R30.1
N$37
  Top 0.508: R35.1 R39.2 54.12,72.59 Q7.1
N$38
  Top 0.508: Q7.3 60.25,71.65 | 60.25,71.65 61,70.9 D16.A 61.65,69.15 CON9.P$1 | R31.2 58.32,73.58 60.25,71.65
N$39
  Top 0.508: R31.1 D12.C
N$40
  Top 0.508: Q8.1 54.12,60.69 R40.2 R36.1
N$41
  Top 0.508: Q8.3 60.25,59.75 | 60.25,59.75 61,59 D17.A 61.65,57.25 CON10.P$1 | R32.2 58.32,61.68 60.25,59.75
N$42
  Top 0.508: R32.1 D13.C
N$43
  Top 0.508: Q9.1 54.12,48.79 R49.2 R45.1
N$44
  Top 0.508: Q9.3 60.25,47.85 | 60.25,47.85 61,47.1 D22.A 61.65,45.35 CON11.P$1 | R41.2 58.32,49.78 60.25,47.85
N$45
  Top 0.508: R41.1 D18.C
N$46
  Top 0.508: Q10.1 54.12,36.89 R50.2 R46.1
N$47
  Top 0.508: Q10.3 60.25,35.95 | 60.25,35.95 61,35.2 D23.A 61.65,33.45 CON12.P$1 | R42.2 58.32,37.88 60.25,35.95
N$48
  Top 0.508: R42.1 D19.C
N$49
  Top 0.508: Q11.1 54.12,24.99 R51.2 R47.1
N$50
  Top 0.508: Q11.3 60.25,24.05 | 60.25,24.05 61,23.3 D24.A 61.65,21.55 CON13.P$1 | R43.2 58.32,25.98 60.25,24.05
N$51
  Top 0.508: R43.1 D20.C
N$52
  Top 0.508: Q12.1 54.12,13.09 R52.2 R48.1
N$53
  Top 0.508: Q12.3 60.25,12.15 | 60.25,12.15 61,11.4 D25.A 61.65,9.65 CON14.P$1 | R44.2 58.32,14.08 60.25,12.15
N$54
  Top 0.508: R44.1 D21.C
R0  (via drill 0.3)
  Top 0.2: v35.9,13 35.87,12.97 R1.1 | v38,48.6 39.05,49.65 U2.8
  Top 0.508: R21.2 R1.1
  Bottom 0.2: v35.9,13 37.2,14.3 37.2,47.8 v38,48.6
R1  (via drill 0.3)
  Top 0.2: v35.9,25 35.77,24.87 R2.1 | v38,49.5 38.65,50.15 U2.7
  Top 0.508: R22.2 R2.1
  Bottom 0.2: v35.9,25 36.87,25.97 36.87,48.37 v38,49.5
R2  (via drill 0.3)
  Top 0.2: v35.9,36.8 34.63,36.8 R3.1 | v38,50.4 38.25,50.65 U2.6
  Top 0.508: R23.2 R3.1
  Bottom 0.2: v35.9,36.8 36.55,37.45 36.55,48.95 v38,50.4
R3  (via drill 0.3)
  Top 0.2: R4.1 v34.6,49.8 | v38.3,52.3 38.45,52.15 U2.3
  Top 0.508: R24.2 R4.1
  Bottom 0.2: v34.6,49.8 37.1,52.3 v38.3,52.3
R4  (via drill 0.3)
  Top 0.2: v35.8,60.5 35.73,60.57 R5.1 | U2.2 38.85,52.65 v38.3,53.2
  Top 0.508: R33.2 R5.1
  Bottom 0.2: v35.8,60.5 36.23,60.07 36.23,55.27 v38.3,53.2
R5  (via drill 0.3)
  Top 0.2: R6.1 35.8,72.47 36.6,71.67 v36.6,64.4 | U2.1 39.15,53.15 v38.3,54
  Top 0.508: R34.2 R6.1
  Bottom 0.2: v38.3,54 36.6,55.7 v36.6,64.4
R6  (via drill 0.3)
  Top 0.2: v49,70.8 49.03,70.83 R7.1 | U2.23 45.85,52.65 46.2,53 v46.2,53.7
  Top 0.508: R7.1 R35.2
  Bottom 0.2: v49,70.8 48.3,70.1 48.2,70 46.2,68 v46.2,53.7
R7  (via drill 0.3)
  Top 0.2: U2.22 46.05,52.15 v46.9,53 | v49.1,58.9 49.13,58.93 R8.1
  Top 0.508: R8.1 R36.2
  Bottom 0.2: v46.9,53 46.9,56.7 v49.1,58.9
R8  (via drill 0.3)
  Top 0.2: U2.19 46.25,50.65 v46.6,50.3 | v49.3,47 49.33,47.03 R9.1
  Top 0.508: R9.1 R45.2
  Bottom 0.2: v46.6,50.3 49.3,47.6 v49.3,47
R9  (via drill 0.3)
  Top 0.2: v49.1,35.1 50.37,35.1 R10.1 | U2.18 45.95,50.15 v46.6,49.5
  Top 0.508: R10.1 R46.2
  Bottom 0.2: v49.1,35.1 48.6,35.6 48.6,47.5 v46.6,49.5
R10  (via drill 0.3)
  Top 0.2: v49,23.3 49.07,23.23 R11.1 | U2.17 45.65,49.65 v46.6,48.7
  Top 0.508: R47.2 R11.1
  Bottom 0.2: v49,23.3 48.27,24.03 48.27,47.03 v46.6,48.7
R11  (via drill 0.3)
  Top 0.2: v49.1,11.4 49.17,11.33 R12.1 | U2.16 44.25,47.95 v44.7,47.5
  Top 0.508: R48.2 R12.1
  Bottom 0.2: v49.1,11.4 47.95,12.55 47.95,44.25 v44.7,47.5
SWCLK  (via drill 0.3)
  Top 0.2: U2.25 44.25,54.55 v44.8,55.1 | v42,64.9 v37.3,69.6 | v31.9,75 v30.6,76.3
  Bottom 0.2: v44.8,55.1 44.8,62.1 v42,64.9 | v37.3,69.6 v31.9,75 | v30.6,76.3 30.6,76.97 v28.73,78.83
SWDIO  (via drill 0.3)
  Top 0.2: U2.26 43.75,55.15 v44.2,55.6 | v42,64.1 v37.3,68.8
  Bottom 0.2: v42,64.1 44.2,61.9 v44.2,55.6 | v37.3,68.8 31.27,74.83 v31.27,78.83
SWO  (via drill 0.3)
  Top 0.2: U2.27 43.25,55.75 v43.6,56.1 | v42,63.3 v37.3,68
  Bottom 0.2: v43.6,56.1 43.6,61.7 v42,63.3 | v37.3,68 29.9,75.4 29.9,76.6 28.93,77.56 TC1.6
  other vias: 27.46,77.56
VIN  (via drill 0.5 pad 1.3)
  Top 0.508: D11.A 25.55,66.85 24,68.4 D15.C 23.35,69.15 CON8.P$2 | D10.A 25.55,54.95 24,56.5 D14.C 23.35,57.25 CON7.P$2 | D5.A 25.55,43.05 24,44.6 D9.C 23.35,45.35 CON6.P$2 | D4.A 25.55,31.15 24,32.7 D8.C 23.35,33.45 CON5.P$2 | D3.A 25.55,19.25 24,20.8 D7.C 23.35,21.55 CON4.P$2 | D2.A 25.55,7.35 24,8.9 D6.C 23.35,9.65 CON3.P$2 | D21.A 59.45,16.95 61,15.4 D25.C 61.65,14.65 CON14.P$2 | D20.A 59.45,28.85 61,27.3 D24.C 61.65,26.55 CON13.P$2 | D19.A 59.45,40.75 61,39.2 D23.C 61.65,38.45 CON12.P$2 | D18.A 59.45,52.65 61,51.1 D22.C 61.65,50.35 CON11.P$2 | D13.A 59.45,64.55 61,63 D17.C 61.65,62.25 CON10.P$2 | D12.A 59.45,76.45 61,74.9 D16.C 61.65,74.15 CON9.P$2
  Top 0.61: v42.5,30.5 42.5,31.3 42.48,31.32 C1.1 R54.2 40.82,34.49 41.11,34.77 U1.3
  Top 1.27: C6.1 42.05,27.95 D1.C | F1.1 43.03,27.87 D1.C | D1.C v42.5,30.5
  Bottom 1.27: 42.5,8.5 37,3 26.65,3 CON3.P$2 16.79,9.61 15.5,10.9 15.5,20.3 16.71,21.51 CON4.P$2 16.79,21.51 15.5,22.8 15.5,32.2 16.71,33.41 CON5.P$2 16.79,33.41 15.5,34.7 15.5,44.1 16.71,45.31 CON6.P$2 16.79,45.31 15.5,46.6 15.5,56 16.71,57.21 CON7.P$2 16.79,57.21 15.5,58.5 15.5,67.9 16.71,69.11 CON8.P$2 | 68.21,62.29 69.5,61 69.5,51.68 68.21,50.39 | 68.21,50.39 69.5,49.1 69.5,39.78 68.21,38.49 | 68.21,38.49 69.5,37.2 69.5,27.88 68.21,26.59 | 68.21,26.59 69.5,25.3 69.5,15.9 68.29,14.69 | 68.29,14.69 69.5,13.48 69.5,7 65.5,3 48,3 42.5,8.5 | CON9.P$2 68.21,74.19 69.5,72.9 69.5,63.58 68.21,62.29 | 68.29,14.69 CON14.P$2 | 68.21,26.59 CON13.P$2 | 68.21,38.49 CON12.P$2 | 68.21,50.39 CON11.P$2 | 68.21,62.29 CON10.P$2 | 42.5,8.5 v42.5,30.5
VIN_VSENSE  (via drill 0.3)
  Top 0.254: R54.1 39.18,34.68 v39.2,34.7
  Top 0.305: U2.10 v41.25,47.2 41.25,46.17 C24.1
  Top 0.813: R53.2 R54.1
  Bottom 0.254: v39.2,34.7 39.2,45.15 v41.25,47.2

### Text on the board
tPlace: IcyRadio Relay Controller v1 / Sep 2020 | - | + | 5 | 6 | + | - | - | + | 4 | 7 | + | - | - | + | 3 | 8 | + | - | - | + | 2 | 9 | + | - | - | + | 1 | 10 | + | - | - | + | 0 | 11 | + | - | - | +